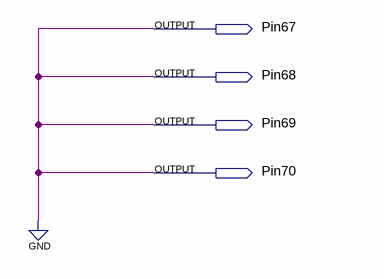
[diagram p0: schematic sheet]
// Quartus schematic basic.bdf as structural Verilog: 0 symbols, 4 pins
module basic (
  output Pin67,
  output Pin68,
  output Pin69,
  output Pin70
);


  assign Pin67 = 1'b0;
  assign Pin68 = 1'b0;
  assign Pin69 = 1'b0;
  assign Pin70 = 1'b0;
endmodule
